# Altium schematic sheet SX1308.SchDoc
size A4
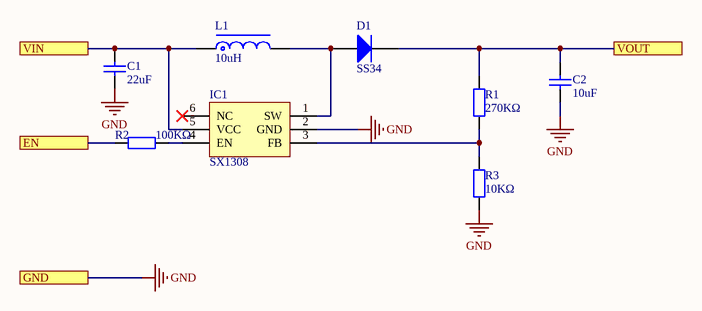
[diagram p0: SX1308.SchDoc]

## Parts
C1  22uF  [LC-0805_C]
C2  10uF  [LC-1206_C]
D1  SS34  [LC-SMA(DO-214AC)_S1]
IC1  SX1308  [SOT23-6N]
L1  10uH  [CDRH73]
R1  270KΩ  [LC-0603_R]
R2  100KΩ  [LC-0603_R]
R3  10KΩ  [LC-0603_R]

## Ports
EN, GND, VIN, VOUT

## Nets
GND: C1.1 C2.1 IC1.2(GND) R3.1 ; port GND
EN: R2.1 ; port EN
VIN: C1.2 IC1.5(VCC) L1.1 ; port VIN
VOUT: C2.2 D1.2(K) R1.2 ; port VOUT
NetD1_1: D1.1(A) IC1.1(SW) L1.2
NetIC1_3: IC1.3(FB) R1.1 R3.2
NetIC1_4: IC1.4(EN) R2.2

Not connected (* = marked no-connect by the designer): IC1 6(NC)*

## Library data of the parts
C1 = 0805 22uF (226) 20% 25V: 贴片电容; ComponentLink1Description: 供应商链接; ComponentLink1URL: http://www.szlcsc.com/product/details_46786.html; Package: 0805; Supplier: LC; SuppliersPartNumber: C45783
C2 = 1206 10uF (106) 10% 50V: 贴片电容; ComponentLink1Description: 供应商链接; ComponentLink1URL: http://www.szlcsc.com/product/details_14236.html; Package: 1206; Supplier: LC; SuppliersPartNumber: C13585
D1 = SMA(DO-214AC) SS54: 二极管; ComponentLink1Description: 供应商链接; ComponentLink1URL: http://www.szlcsc.com/product/details_23178.html; Package: SMA(DO-214AC); Supplier: LC; SuppliersPartNumber: C22452
IC1 = SX1308: 可调升压芯片; 版权归属: 封装库来自淘宝 ID：黄晶宝石; BOM名称: 可调升压芯片; 学习资源: www.ooocke.com
L1 = L-CDRH: 功率屏蔽电感; 版权归属: 封装库来自淘宝 ID：黄晶宝石; BOM名称: 功率屏蔽电感; 联系售后: https://shop463601444.taobao.com
R1 = 0603 390KΩ (3903) 1%: 贴片电阻; ComponentLink1Description: 供应商链接; ComponentLink1URL: http://www.szlcsc.com/product/details_23877.html; Package: 0603; Supplier: LC; SuppliersPartNumber: C23150
R2 = 0603 100KΩ (1003) 1%: 贴片电阻; ComponentLink1Description: 供应商链接; ComponentLink1URL: http://www.szlcsc.com/product/details_26546.html; Package: 0603; Supplier: LC; SuppliersPartNumber: C25803
R3 = 0603 10KΩ (1002) 1%: 贴片电阻; ComponentLink1Description: 供应商链接; ComponentLink1URL: http://www.szlcsc.com/product/details_26547.html; Package: 0603; Supplier: LC; SuppliersPartNumber: C25804